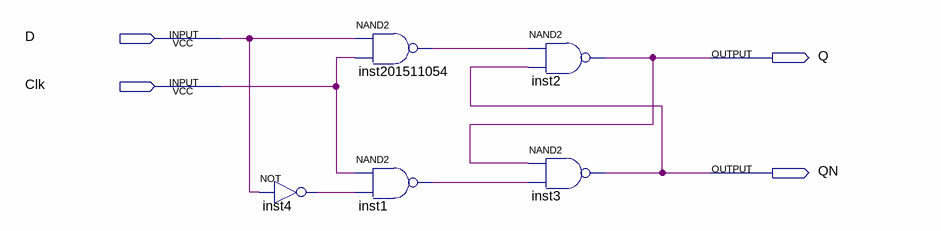
[diagram p0: schematic sheet]
// Quartus schematic lab05_1.bdf as structural Verilog: 5 symbols, 4 pins
module lab05_1 (
  input  D,
  input  Clk,
  output Q,
  output QN
);

  wire inst1_out, inst4_out, inst201511054_out;

  not inst4 (inst4_out, D);
  nand inst201511054 (inst201511054_out, D, Clk);
  nand inst1 (inst1_out, Clk, inst4_out);
  nand inst2 (Q, inst201511054_out, QN);
  nand inst3 (QN, Q, inst1_out);
endmodule
